# EAGLE schematic Ariel v5.5 (EAGLE 9.3.0)
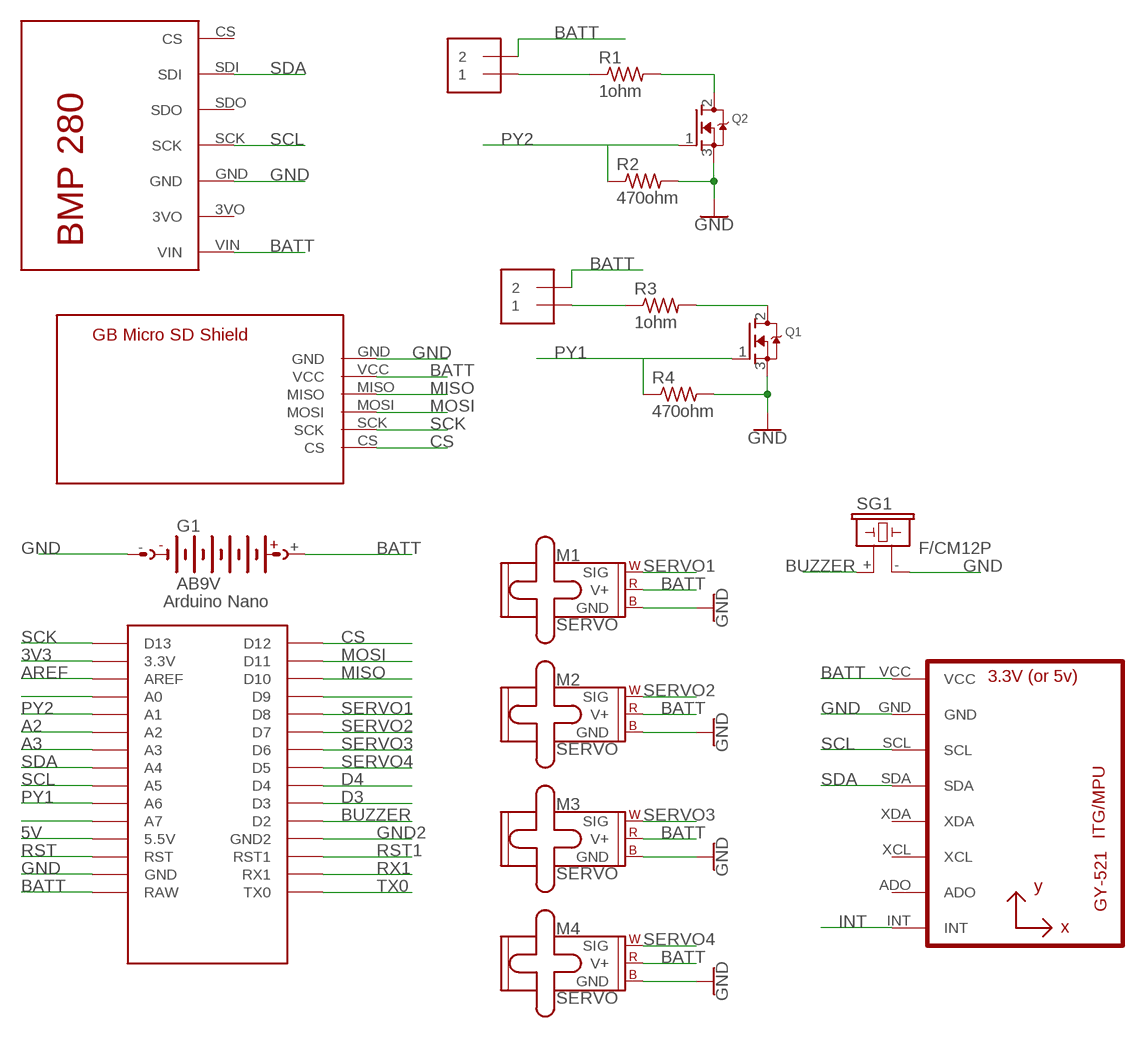
[diagram p0: schematic, sheet 1]

## Parts
G1  AB9V  [AB9V]
J1  1X2-3.5MM  [1X2-3.5MM]
J2  1X2-3.5MM  [1X2-3.5MM]
M1  SERVO  [1X03]
M2  SERVO  [1X03]
M3  SERVO  [1X03]
M4  SERVO  [1X03]
Q1  MOSFET-NGDS_TO220V  [TO220V]
Q2  MOSFET-NGDS_TO220V  [TO220V]
R1  1ohm  FLIPFLOP-RES  [0805-THM]
R2  470ohm  FLIPFLOP-RES  [0805-THM]
R3  1ohm  FLIPFLOP-RES  [0805-THM]
R4  470ohm  FLIPFLOP-RES  [0805-THM]
SG1  F/CM12P  [F/CM12P]
U1  GY-521MPU6050  [GY-521]
U$1  NANO  [NANO]
U$2  BMP280  [BMP280]
U$3  GBMICROSDSHIELD  [GBMICROSDSHIELD]

## Nets
3V3: U$1.3.3V
5V: U$1.5V(5.5V)
A2: U$1.A2
A3: U$1.A3
AREF: U$1.AREF
BATT: G1.+ J1.2 J2.2 M1.2(V+) M2.2(V+) M3.2(V+) M4.2(V+) U1.VCC U$1.RAW U$2.VIN U$3.VCC
BUZZER: SG1.+ U$1.D2
CS: U$1.D12 U$3.CS
D3: U$1.D3
D4: U$1.D4
GND: G1.- M1.3(GND) M2.3(GND) M3.3(GND) M4.3(GND) Q1.3(S) Q2.3(S) R2.2 R4.2 SG1.- U1.GND U$1.GND U$2.GND U$3.GND
GND2: U$1.GND1(GND2)
INT: U1.INT
MISO: U$1.D10 U$3.MISO
MOSI: U$1.D11 U$3.MOSI
N$1: J1.1 R1.1
N$2: Q2.2(D) R1.2
N$3: U$1.D9
N$4: J2.1 R3.1
N$5: Q1.2(D) R3.2
N$6: U$1.A7
N$7: U$1.A0
PY1: Q1.1(G) R4.1 U$1.A6
PY2: Q2.1(G) R2.1 U$1.A1
RST: U$1.RST
RST1: U$1.RST1
RX1: U$1.RX1
SCK: U$1.D13 U$3.SCK
SCL: U1.SCL U$1.A5 U$2.SCK
SDA: U1.SDA U$1.A4 U$2.SDI
SERVO1: M1.1(SIG) U$1.D8
SERVO2: M2.1(SIG) U$1.D7
SERVO3: M3.1(SIG) U$1.D6
SERVO4: M4.1(SIG) U$1.D5
TX0: U$1.TX0
Unconnected: U1.ADO U1.XCL U1.XDA U$1.ICSP1 U$1.ICSP2 U$1.ICSP3 U$1.ICSP4 U$1.ICSP5 U$1.ICSP6 U$2.3VO U$2.CS U$2.SDO

## Library data of the parts
G1 = battery:AB9V: 9-V BATTERY CLIP
J1 J2 = adafruit:1X2: 3.5mm Terminal block http://www.ladyada.net/library/pcb/eaglelibrary.html
M1-M4 = SparkFun-Electromechanical:SERVO: Servo Motor 3-pin connector for a standard servo motor (voltage supply, ground, and control signal.) SparkFun Products Servo - Generic (Sub-Micro Size) <https://www.sparkfun.com/products/9065> (ROB-09065) Servo - Generic High Torque Continuous Rotation (Standard Size) <https://www.sparkfun.com/products/9347> (ROB-09347) Servo - Generic High Torque (Standard Size) <https://www.sparkfun.com/products/11965> (ROB-11965)
Q1 Q2 = adafruit:MOSFET-N: N-Channel Mosfet 2N7002E - 60V 260mA SOT23 [Digikey: 2N7002ET1GOSTR-ND] - REEL BSH103 - 30V 850mA SOT23 [Digikey: 568-5013-1-ND]
R1-R4 = adafruit:FLIPFLOP-RES: Flip Flop resistor An 0805 resistor inside a standard 1/4W 5% resistor. Makes for easy mods
SG1 = buzzer:F/CM12P: BUZZER Source: Buerklin; OC_FARNELL: unknown; OC_NEWARK: unknown
U1 = gy-521:GY-521
U$1 = Arduino-clone:NANO: Arduino Nano
U$2 = BMP280:BMP280
U$3 = GB Micro SD Card Shield:GBMICROSDSHIELD

## Net classes
0 default: width 0.75 mm, clearance 0.35 mm